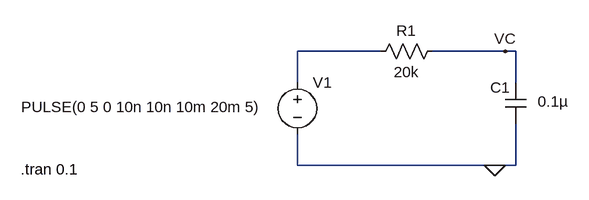
[diagram p0: schematic EEG_2021_099simple RC circuit.asc]
EEG_2021_099simple RC circuit.asc, the LTspice schematic file:
Version 4
SHEET 1 880 680
WIRE 144 112 16 112
WIRE 336 112 224 112
WIRE 352 112 336 112
WIRE 16 160 16 112
WIRE 352 160 352 112
WIRE 16 288 16 240
WIRE 320 288 16 288
WIRE 352 288 352 224
WIRE 352 288 320 288
FLAG 320 288 0
FLAG 336 112 VC
SYMBOL res 240 96 R90
WINDOW 0 0 56 VBottom 2
WINDOW 3 32 56 VTop 2
SYMATTR InstName R1
SYMATTR Value 20k
SYMBOL cap 368 224 R180
WINDOW 0 24 56 Left 2
WINDOW 3 -65 35 Left 2
SYMATTR InstName C1
SYMATTR Value 0.1µ
SYMBOL voltage 16 144 R0
WINDOW 3 -425 54 Left 2
WINDOW 123 0 0 Left 0
WINDOW 39 0 0 Left 0
SYMATTR InstName V1
SYMATTR Value PULSE(0 5 0 10n 10n 10m 20m 5)
TEXT -410 294 Left 2 !.tran 0.1

The netlist it stands for:
* EEG_2021_099simple RC circuit.asc
R1 VC N001 20k
C1 0 VC 0.1µ
V1 N001 0 PULSE(0 5 0 10n 10n 10m 20m 5)
.tran 0.1
.backanno
.end